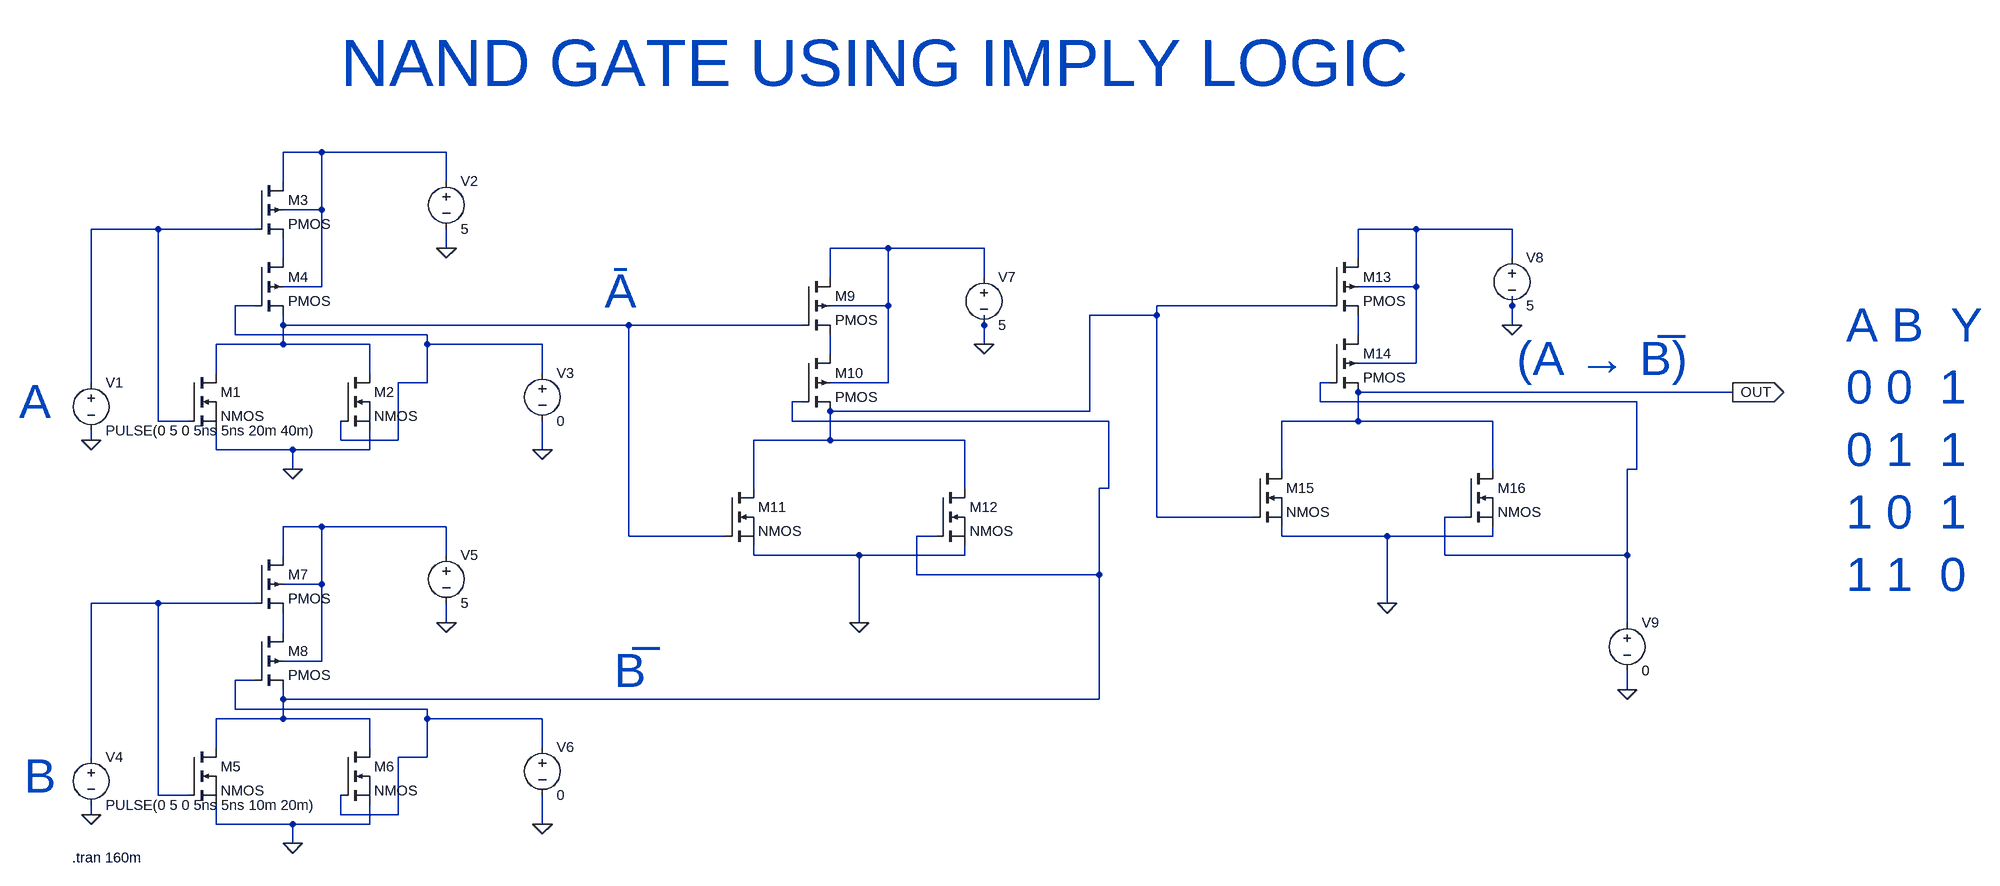
[diagram p0: schematic originalnandgateimply.asc]
originalnandgateimply.asc, the LTspice schematic file:
Version 4
SHEET 1 1608 680
WIRE -1200 -512 -1264 -512
WIRE -992 -512 -1200 -512
WIRE -1264 -464 -1264 -512
WIRE -992 -464 -992 -512
WIRE -1200 -416 -1200 -512
WIRE -1200 -416 -1264 -416
WIRE -1472 -384 -1584 -384
WIRE -1312 -384 -1472 -384
WIRE 624 -384 528 -384
WIRE 784 -384 624 -384
WIRE -992 -352 -992 -384
WIRE -256 -352 -352 -352
WIRE -96 -352 -256 -352
WIRE -1264 -336 -1264 -368
WIRE 528 -336 528 -384
WIRE 784 -336 784 -384
WIRE -352 -304 -352 -352
WIRE -96 -304 -96 -352
WIRE -1200 -288 -1200 -416
WIRE -1200 -288 -1264 -288
WIRE 624 -288 624 -384
WIRE 624 -288 528 -288
WIRE -1312 -256 -1344 -256
WIRE -256 -256 -256 -352
WIRE -256 -256 -352 -256
WIRE 480 -256 192 -256
WIRE 784 -256 784 -272
WIRE 192 -240 192 -256
WIRE 192 -240 80 -240
WIRE -1264 -224 -1264 -240
WIRE -688 -224 -1264 -224
WIRE -400 -224 -688 -224
WIRE -96 -224 -96 -240
WIRE 784 -224 784 -256
WIRE -1344 -208 -1344 -256
WIRE -1024 -208 -1344 -208
WIRE 528 -208 528 -240
WIRE -1264 -192 -1264 -224
WIRE -1264 -192 -1376 -192
WIRE -1120 -192 -1264 -192
WIRE -1024 -192 -1024 -208
WIRE -832 -192 -1024 -192
WIRE -96 -192 -96 -224
WIRE -352 -176 -352 -208
WIRE 624 -160 624 -288
WIRE 624 -160 528 -160
WIRE -1376 -144 -1376 -192
WIRE -1120 -144 -1120 -192
WIRE -832 -144 -832 -192
WIRE -1584 -128 -1584 -384
WIRE -1024 -128 -1024 -192
WIRE -1024 -128 -1072 -128
WIRE -256 -128 -256 -256
WIRE -256 -128 -352 -128
WIRE 480 -128 464 -128
WIRE 1152 -112 528 -112
WIRE -400 -96 -416 -96
WIRE 464 -96 464 -128
WIRE 992 -96 464 -96
WIRE 80 -80 80 -240
WIRE 80 -80 -352 -80
WIRE -1472 -64 -1472 -384
WIRE -1424 -64 -1472 -64
WIRE -416 -64 -416 -96
WIRE 112 -64 -416 -64
WIRE 528 -64 528 -112
WIRE 528 -64 400 -64
WIRE 752 -64 528 -64
WIRE -1584 -32 -1584 -48
WIRE -1168 -32 -1168 -64
WIRE -1072 -32 -1072 -128
WIRE -1072 -32 -1168 -32
WIRE -352 -32 -352 -80
WIRE -352 -32 -480 -32
WIRE -128 -32 -352 -32
WIRE -1376 -16 -1376 -48
WIRE -1248 -16 -1376 -16
WIRE -1120 -16 -1120 -48
WIRE -1120 -16 -1248 -16
WIRE -832 -16 -832 -64
WIRE -1248 16 -1248 -16
WIRE 400 16 400 -64
WIRE 752 16 752 -64
WIRE 992 16 992 -96
WIRE 992 16 976 16
WIRE -480 48 -480 -32
WIRE -128 48 -128 -32
WIRE 112 48 112 -64
WIRE 112 48 96 48
WIRE 192 96 192 -240
WIRE 352 96 192 96
WIRE 704 96 672 96
WIRE -1200 112 -1264 112
WIRE -992 112 -1200 112
WIRE -688 128 -688 -224
WIRE -528 128 -688 128
WIRE -176 128 -208 128
WIRE 400 128 400 112
WIRE 576 128 400 128
WIRE 752 128 752 112
WIRE 752 128 576 128
WIRE -1264 160 -1264 112
WIRE -992 160 -992 112
WIRE -480 160 -480 144
WIRE -304 160 -480 160
WIRE -128 160 -128 144
WIRE -128 160 -304 160
WIRE 672 160 672 96
WIRE 976 160 976 16
WIRE 976 160 672 160
WIRE -208 192 -208 128
WIRE 96 192 96 48
WIRE 96 192 -208 192
WIRE -1200 208 -1200 112
WIRE -1200 208 -1264 208
WIRE -1472 240 -1584 240
WIRE -1312 240 -1472 240
WIRE 576 240 576 128
WIRE -992 272 -992 240
WIRE -304 272 -304 160
WIRE 976 272 976 160
WIRE -1264 288 -1264 256
WIRE -1200 336 -1200 208
WIRE -1200 336 -1264 336
WIRE -1312 368 -1344 368
WIRE 976 384 976 352
WIRE -1264 400 -1264 384
WIRE 96 400 96 192
WIRE 96 400 -1264 400
WIRE -1344 416 -1344 368
WIRE -1024 416 -1344 416
WIRE -1264 432 -1264 400
WIRE -1264 432 -1376 432
WIRE -1120 432 -1264 432
WIRE -1024 432 -1024 416
WIRE -832 432 -1024 432
WIRE -1376 480 -1376 432
WIRE -1120 480 -1120 432
WIRE -832 480 -832 432
WIRE -1584 496 -1584 240
WIRE -1024 496 -1024 432
WIRE -1024 496 -1072 496
WIRE -1472 560 -1472 240
WIRE -1424 560 -1472 560
WIRE -1584 592 -1584 576
WIRE -1168 592 -1168 560
WIRE -1072 592 -1072 496
WIRE -1072 592 -1168 592
WIRE -1376 608 -1376 576
WIRE -1248 608 -1376 608
WIRE -1120 608 -1120 576
WIRE -1120 608 -1248 608
WIRE -832 608 -832 560
WIRE -1248 640 -1248 608
FLAG -992 -352 0
FLAG -1248 16 0
FLAG -1584 -32 0
FLAG -832 -16 0
FLAG -992 272 0
FLAG -1248 640 0
FLAG -1584 592 0
FLAG -832 608 0
FLAG -304 272 0
FLAG -96 -192 0
FLAG 576 240 0
FLAG 784 -224 0
FLAG 976 384 0
FLAG 1152 -112 OUT
IOPIN 1152 -112 Out
SYMBOL nmos -1424 -144 R0
SYMATTR InstName M1
SYMBOL voltage -1584 -144 R0
WINDOW 123 0 0 Left 0
WINDOW 39 0 0 Left 0
SYMATTR InstName V1
SYMATTR Value PULSE(0 5 0 5ns 5ns 20m 40m)
SYMBOL voltage -992 -480 R0
WINDOW 123 0 0 Left 0
WINDOW 39 0 0 Left 0
SYMATTR InstName V2
SYMATTR Value 5
SYMBOL voltage -832 -160 R0
WINDOW 123 0 0 Left 0
WINDOW 39 0 0 Left 0
SYMATTR InstName V3
SYMATTR Value 0
SYMBOL nmos -1168 -144 R0
SYMATTR InstName M2
SYMBOL pmos4 -1312 -464 R0
SYMATTR InstName M3
SYMBOL pmos4 -1312 -336 R0
SYMATTR InstName M4
SYMBOL nmos -1424 480 R0
SYMATTR InstName M5
SYMBOL voltage -1584 480 R0
WINDOW 123 0 0 Left 0
WINDOW 39 0 0 Left 0
SYMATTR InstName V4
SYMATTR Value PULSE(0 5 0 5ns 5ns 10m 20m)
SYMBOL voltage -992 144 R0
WINDOW 123 0 0 Left 0
WINDOW 39 0 0 Left 0
SYMATTR InstName V5
SYMATTR Value 5
SYMBOL voltage -832 464 R0
WINDOW 123 0 0 Left 0
WINDOW 39 0 0 Left 0
SYMATTR InstName V6
SYMATTR Value 0
SYMBOL nmos -1168 480 R0
SYMATTR InstName M6
SYMBOL pmos4 -1312 160 R0
SYMATTR InstName M7
SYMBOL pmos4 -1312 288 R0
SYMATTR InstName M8
SYMBOL pmos4 -400 -304 R0
SYMATTR InstName M9
SYMBOL pmos4 -400 -176 R0
SYMATTR InstName M10
SYMBOL nmos -528 48 R0
SYMATTR InstName M11
SYMBOL nmos -176 48 R0
SYMATTR InstName M12
SYMBOL voltage -96 -320 R0
WINDOW 123 0 0 Left 0
WINDOW 39 0 0 Left 0
SYMATTR InstName V7
SYMATTR Value 5
SYMBOL pmos4 480 -336 R0
SYMATTR InstName M13
SYMBOL pmos4 480 -208 R0
SYMATTR InstName M14
SYMBOL nmos 352 16 R0
SYMATTR InstName M15
SYMBOL nmos 704 16 R0
SYMATTR InstName M16
SYMBOL voltage 784 -352 R0
WINDOW 123 0 0 Left 0
WINDOW 39 0 0 Left 0
SYMATTR InstName V8
SYMATTR Value 5
SYMBOL voltage 976 256 R0
WINDOW 123 0 0 Left 0
WINDOW 39 0 0 Left 0
SYMATTR InstName V9
SYMATTR Value 0
TEXT -1616 664 Left 2 !.tran 160m
TEXT -1704 -96 Left 6 ;A
TEXT -1696 528 Left 6 ;B
TEXT -712 352 Left 6 ;B̅
TEXT -728 -280 Left 6 ;Ā
TEXT 792 -168 Left 6 ;(A → B̅)
TEXT -1168 -736 Left 7 ;NAND GATE USING IMPLY LOGIC
TEXT 1344 -224 Left 6 ;A B  Y\n0 0  1\n0 1  1\n1 0  1\n1 1  0

The netlist it stands for:
* originalnandgateimply.asc
M1 N008 N002 0 0 NMOS
V1 N002 0 PULSE(0 5 0 5ns 5ns 20m 40m)
V2 N001 0 5
V3 N006 0 0
M2 N008 N006 0 0 NMOS
M3 N001 N002 N005 N001 PMOS
M4 N005 N006 N008 N001 PMOS
M5 N012 N014 0 0 NMOS
V4 N014 0 PULSE(0 5 0 5ns 5ns 10m 20m)
V5 N013 0 5
V6 N016 0 0
M6 N012 N016 0 0 NMOS
M7 N013 N014 N015 N013 PMOS
M8 N015 N016 N012 N013 PMOS
M9 N004 N008 N010 N004 PMOS
M10 N010 N012 N007 N004 PMOS
M11 N007 N008 0 0 NMOS
M12 N007 N012 0 0 NMOS
V7 N004 0 5
M13 N003 N007 N009 N003 PMOS
M14 N009 N011 OUT N003 PMOS
M15 OUT N007 0 0 NMOS
M16 OUT N011 0 0 NMOS
V8 N003 0 5
V9 N011 0 0
.model NMOS NMOS
.model PMOS PMOS
.lib standard.mos
.tran 160m
* A
* B
* B̅
* Ā
* (A → B̅)
* NAND GATE USING IMPLY LOGIC
* A B  Y
* 0 0  1
* 0 1  1
* 1 0  1
* 1 1  0
.backanno
.end